# Altium schematic sheet 7-PWM_INTERLOCK.SchDoc: PWM INTERLOCK
size C; Author: A.COSNEAU; CompanyName: e-TESC LAB; DrawnBy: A.COSNEAU; Engineer: A.COSNEAU; Organization: e-TESC; Address1: Genie / GEGI; Address2: 2500 boulevard de l'universite; Address3: J1K2R SHERBROOKE; Address4: QUEBEC, CANADA
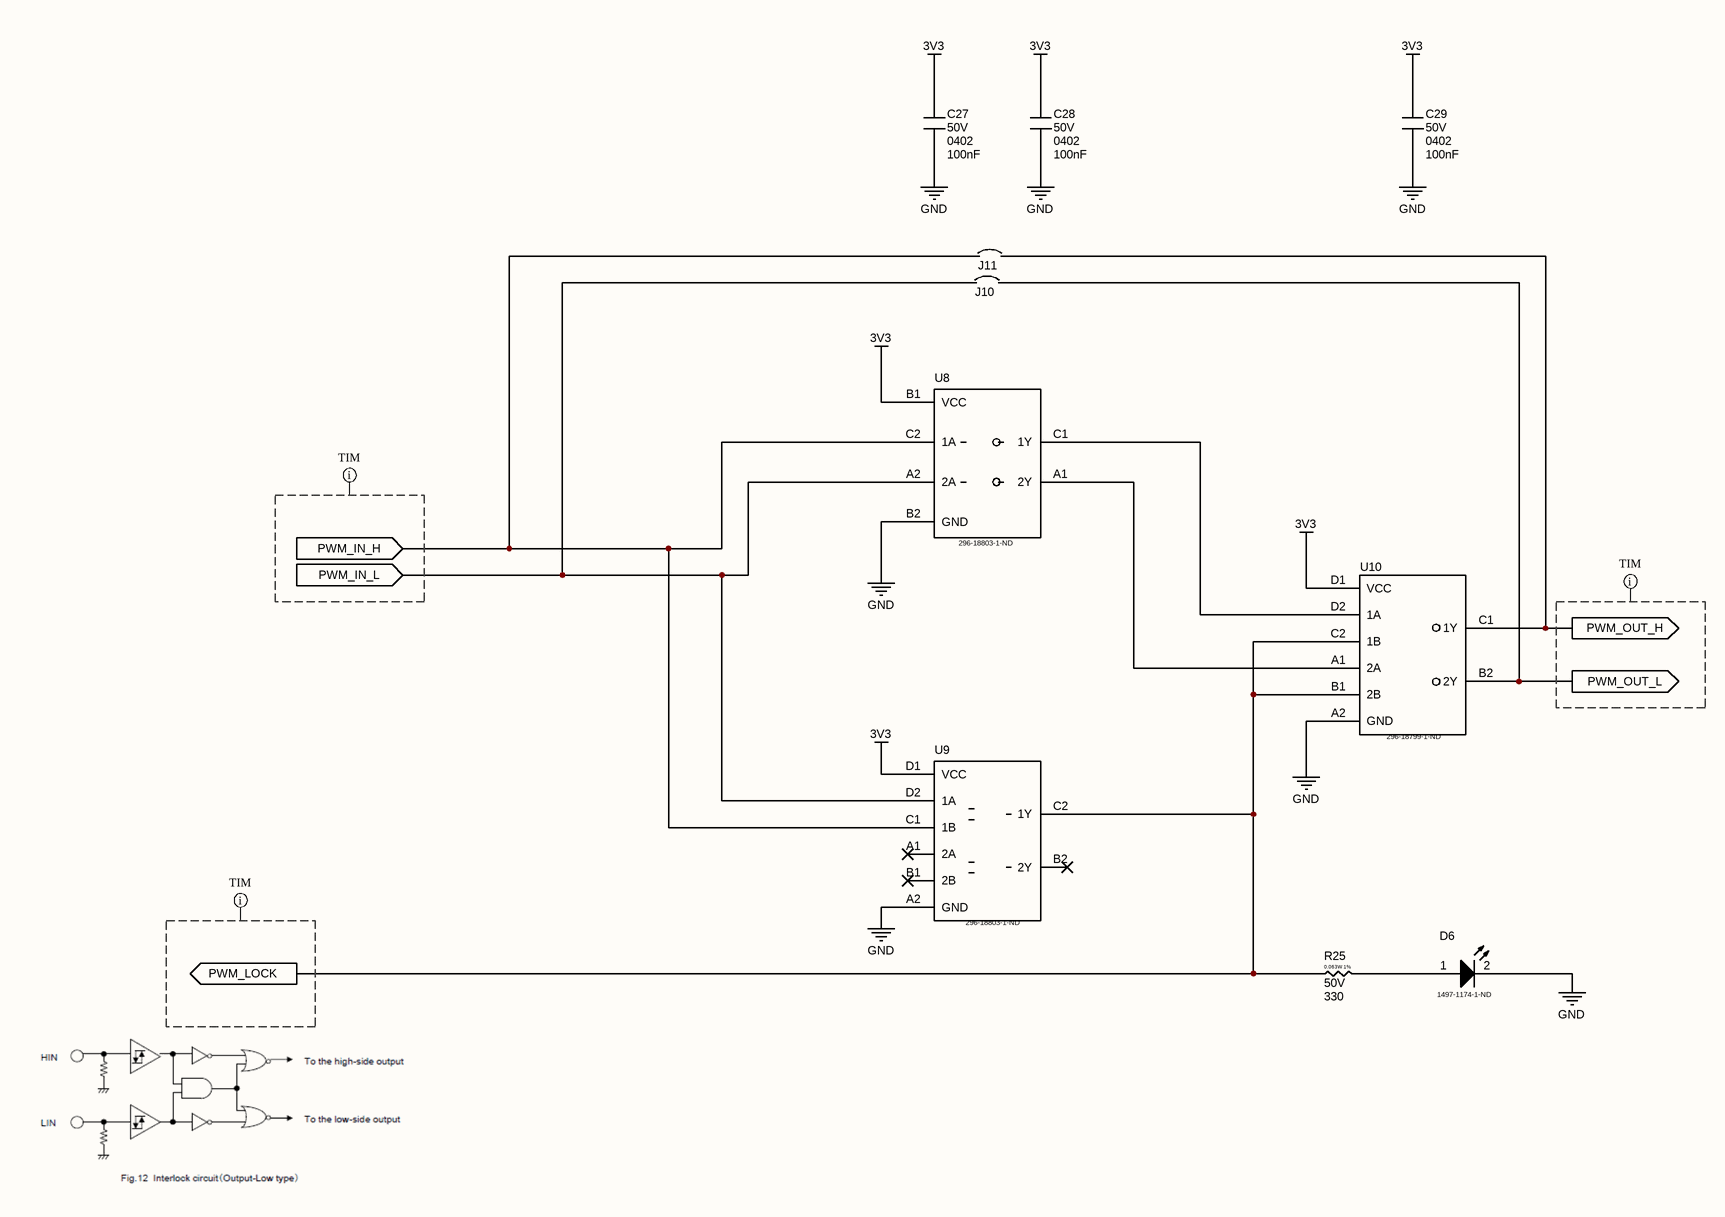
[diagram p0: 7-PWM_INTERLOCK.SchDoc]

## Parts
C27  VDC: 50V  Package: 0402  [C 0402(1005)x0.5]  (hidden comment: 100nF)
C28  VDC: 50V  Package: 0402  [C 0402(1005)x0.5]  (hidden comment: 100nF)
C29  VDC: 50V  Package: 0402  [C 0402(1005)x0.5]  (hidden comment: 100nF)
D6  Supplier Part Number 1: 1497-1174-1-ND  [LED 0402]  (hidden comment: 0402)
J10  SHORT_PARALLEL  [SHORT_PARALLEL]  (value not drawn)  (net tie, no BOM)
J11  SHORT_PARALLEL  [SHORT_PARALLEL]  (value not drawn)  (net tie, no BOM)
R25  VDC: 50V  [R 0402(1005)-1%]  (hidden comment: 330)
U8  Supplier Part Number 1: 296-18803-1-ND  [DSBGA-6]  (hidden comment: DSGBA6)
U9  Supplier Part Number 1: 296-18803-1-ND  [DSBGA-8]  (hidden comment: DSGBA8)
U10  Supplier Part Number 1: 296-18799-1-ND  [DSBGA-8]  (hidden comment: DSBGA8)

## Ports
PWM_IN_H (in), PWM_IN_L (in), PWM_LOCK (out), PWM_OUT_H (out), PWM_OUT_L (out)

## Nets
3V3: C27.1 C28.1 C29.1 U8.B1(VCC) U9.D1(VCC) U10.D1(VCC)
GND: C27.2 C28.2 C29.2 D6.2 U8.B2(GND) U9.A2(GND) U10.A2(GND)
PWM_IN_H: J11.1 U8.C2(1A) U9.C1(1B) ; port PWM_IN_H
PWM_IN_L: J10.1 U8.A2(2A) U9.D2(1A) ; port PWM_IN_L
PWM_LOCK: R25.1 U9.C2(1Y) U10.B1(2B) U10.C2(1B) ; port PWM_LOCK
PWM_OUT_H: J11.2 U10.C1(1Y) ; port PWM_OUT_H
PWM_OUT_L: J10.2 U10.B2(2Y) ; port PWM_OUT_L
NetD6_1: D6.1 R25.2
NetU8_A1: U8.A1(2Y) U10.A1(2A)
NetU8_C1: U8.C1(1Y) U10.D2(1A)

Not connected (* = marked no-connect by the designer): U9 A1(2A)* B1(2B)* B2(2Y)*

## Layout directives
net class TIM: (no net found under the mark)

## Notes on the sheet
- Size:
- Title:
- A
- Revision:
- Author:
- Date:
- File:
- Time:
- Sheet
- of
- (in symbol RES 0402-1%) 0.063W 1%

## Library data of the parts
C27-C29 = CAP 0402 100nF 50V X7R: SMD-0402 100nF 50V X7R 10%; Part Number: CL05B104KB5NNNC; Manufacturer: Samsung; TYPE: Capacitors; Package-mm: 1005; Mount Type: SMT; Publisher: Hefest; Manufacturer Alternate: *; Part Number Alternate: *; Published: 07.04.2019; Supplier 1: Comet; Supplier 2: *; Supplier 3: *; Supplier Part Number 1: C0402 100nF 50V X7R; Supplier Part Number 2: *; Supplier Part Number 3: *; RoHS: Y; Technology: Ceramic  MLCC; Value 1: *; Value 2: *; TempCo: X7R; Tolerance %: ±10%; VAC: *; ESR Ohm: *; ComponentLink1Description: Datasheet link; ComponentLink1URL: https://store.comet.bg/download-file.php?id=11; Temperature Range: -55°C ~ +125°C; Price: 0.039; Value: 100nF
D6 = LED 0402: LED SMD 0402; Supplier 1: Digi-Key; TYPE: LED; PACKAGE: 0402
J10 J11 = SHORT_PARALLEL: SHORTABLE PARALLEL PCB LINK
R25 = RES 0402-1%: SMD 0402 0.063W 1% 50V; Manufacturer: YAGEO; TempCo: ±100ppm/°C; Package-mm: 1005; Value Code: 1001; Power: 0.0625W; Part Number: *; Mount Type: SMT; Publisher: Hefest; Manufacturer Alternate: *; Published: 07.04.2019; Supplier 1: Comet; Supplier 2: *; Supplier 3: *; Supplier Part Number 1: R0402 1.0K 1% YAG/ASJ; Supplier Part Number 2: *; Supplier Part Number 3: *; RoHS: Y; Technology: Thick film; Value 2: *; Package: 0402; Tolerance %: ±1%; ComponentLink1Description: Datasheet link; ComponentLink1URL: https://store.comet.bg/download-file.php?id=1224; Temperature Range: -55°C ~ +155°C; Price: 0.015; Part Number Alternate: *; TYPE: Resistor; Value 1: *; Value: 330
U8 = SN74LVC2G14_BGA: INV DUAL SCHMITT; TYPE: INV; PACKAGE 1: DSGBA6; Supplier 1: Digi-Key
U9 = SN74LVC2G08_BGA: AND DUAL SCHMITT; PACKAGE 1: DSBGA8; TYPE: AND; Supplier 1: Digi-Key
U10 = SN74LVC2G02_BGA: NOR DUAL; PACKAGE 1: DSBGA8; TYPE: NOR; Supplier 1: Digi-Key